# EAGLE design Adafruit Feather M0 RFMxx (EAGLE 9.6.2)
COMPANY: ADAFRUIT INDUSTRIES; DRAWN: KTOWN; REV: B
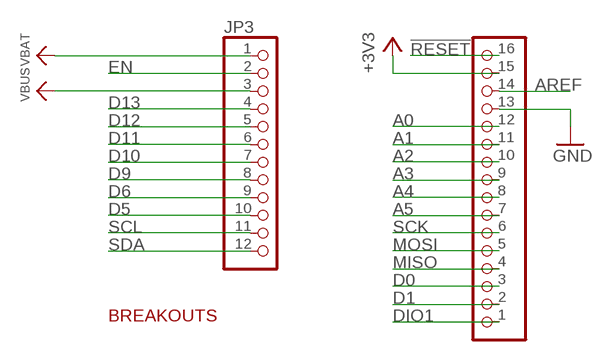
[diagram p0: schematic, sheet 1]

## Parts
JP1  HEADER-1X16ROUND  [1X16_ROUND]
JP3  HEADER-1X12  [1X12_ROUND]

## Nets
!RESET: JP1.16
+3V3: JP1.15
A0: JP1.12
A1: JP1.11
A2: JP1.10
A3: JP1.9
A4: JP1.8
A5: JP1.7
AREF: JP1.14
D0: JP1.3
D1: JP1.2
D5: JP3.10
D6: JP3.9
D9: JP3.8
D10: JP3.7
D11: JP3.6
D12: JP3.5
D13: JP3.4
DIO1: JP1.1
EN: JP3.2
GND: JP1.13
MISO: JP1.4
MOSI: JP1.5
SCK: JP1.6
SCL: JP3.11
SDA: JP3.12
VBAT: JP3.1
VBUS: JP3.3

## Notes on the sheet
- BREAKOUTS

## Library data of the parts
JP1 = microbuilder:HEADER-1X16: PIN HEADER
JP3 = microbuilder:HEADER-1X12

## Board
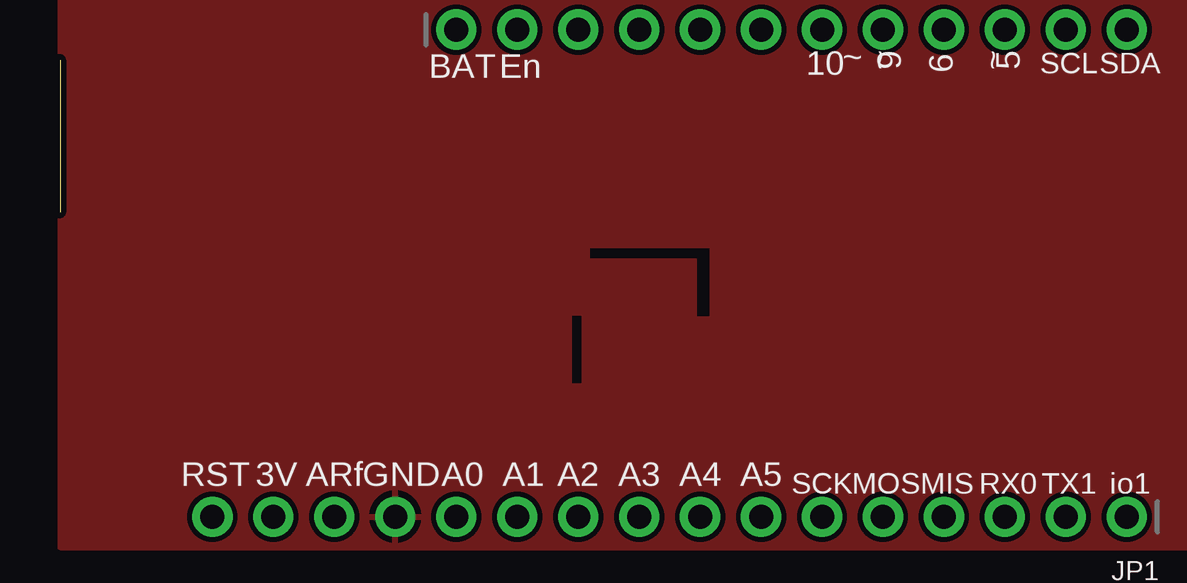
[diagram p1: board, top side]
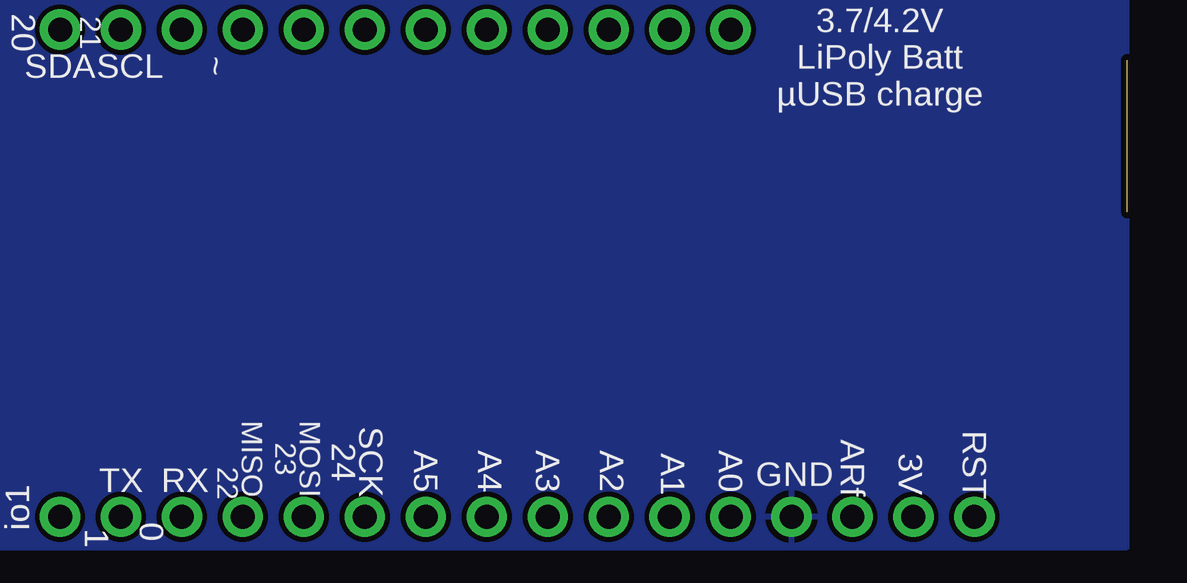
[diagram p2: board, bottom side, seen from below]

Size 0 x 6.35 mm. Coordinates in mm from the lower left corner, seen from the top.
Outline: 0,6.35 0,0
Copper layers (1*16): Top 0.035mm / dielectric 1.5mm / Bottom 0.035mm
Design rules "adafruit *": minimum track width 8mil, minimum drill 15.5mil, track to track 8mil, track to pad 8mil, pad to pad 8mil, via to via 8mil, smd to smd 8mil, copper to edge 10mil, drill to drill 8mil, minimum pad ring 10mil, minimum via ring 8mil, stop-mask expansion 2mil, vias tented up to drill 20mil, thermal gap 10mil
tRestrict: area 21.3,-7.1 to 21.7,-4.3; area 22.1,-1.9 to 27.1,-1.5; area 26.5,-4.3 to 27.1,-1.8

### Footprints (pad centres in the part's own frame; a part is rotated, then mirrored left to right if it is on the bottom)
1X16_ROUND = drill 1 pad 1.676: 1 -19.05,0; 2 -16.51,0; 3 -13.97,0; 4 -11.43,0; 5 -8.89,0; 6 -6.35,0; 7 -3.81,0; 8 -1.27,0; 9 1.27,0; 10 3.81,0; 11 6.35,0; 12 8.89,0; 13 11.43,0; 14 13.97,0; 15 16.51,0; 16 19.05,0
1X12_ROUND = drill 1 pad 1.676: 1 -13.97,0; 2 -11.43,0; 3 -8.89,0; 4 -6.35,0; 5 -3.81,0; 6 -1.27,0; 7 1.27,0; 8 3.81,0; 9 6.35,0; 10 8.89,0; 11 11.43,0; 12 13.97,0

### Placement (x,y rotation side)
JP1  25.4,-12.7 180 top  (outside the outline)
JP3  30.48,7.62 0 top  (outside the outline)

### Tracks (layer width: path | path; a pad name or v marks a point on that pad's centre or on a via)
!RESET
  Top 0.254: JP1.16 6.48,-12.7
GND
  pour Top: 0,8.89 0,-13.97 50.93,-13.97 50.93,8.89
  pour Bottom: 50.93,-13.97 0,-13.97 0,8.89 50.93,8.89

### Text on the board
tPlace: BAT | En | 10 | ~ | ~ | 9 | 6 | ~ | 5 | SCL | SDA | RST | 3V | ARf | GND | A0 | A1 | A2 | A3 | A4 | A5 | SCK | MOS | MIS | RX0 | TX1 | io1
bPlace: 21 | 20 | 3.7/4.2V / LiPoly Batt / µUSB charge | ~ | SCL | SDA | SCK | 24 | MOSI | 23 | MISO | RST | 3V | ARf | GND | A0 | A1 | A2 | A3 | A4 | A5 | 22 | RX | TX | io1 | 0 | 1